# EAGLE design Jarduino (EAGLE 6.6.0)

## Sheet 1 of 2: Arduino | USB
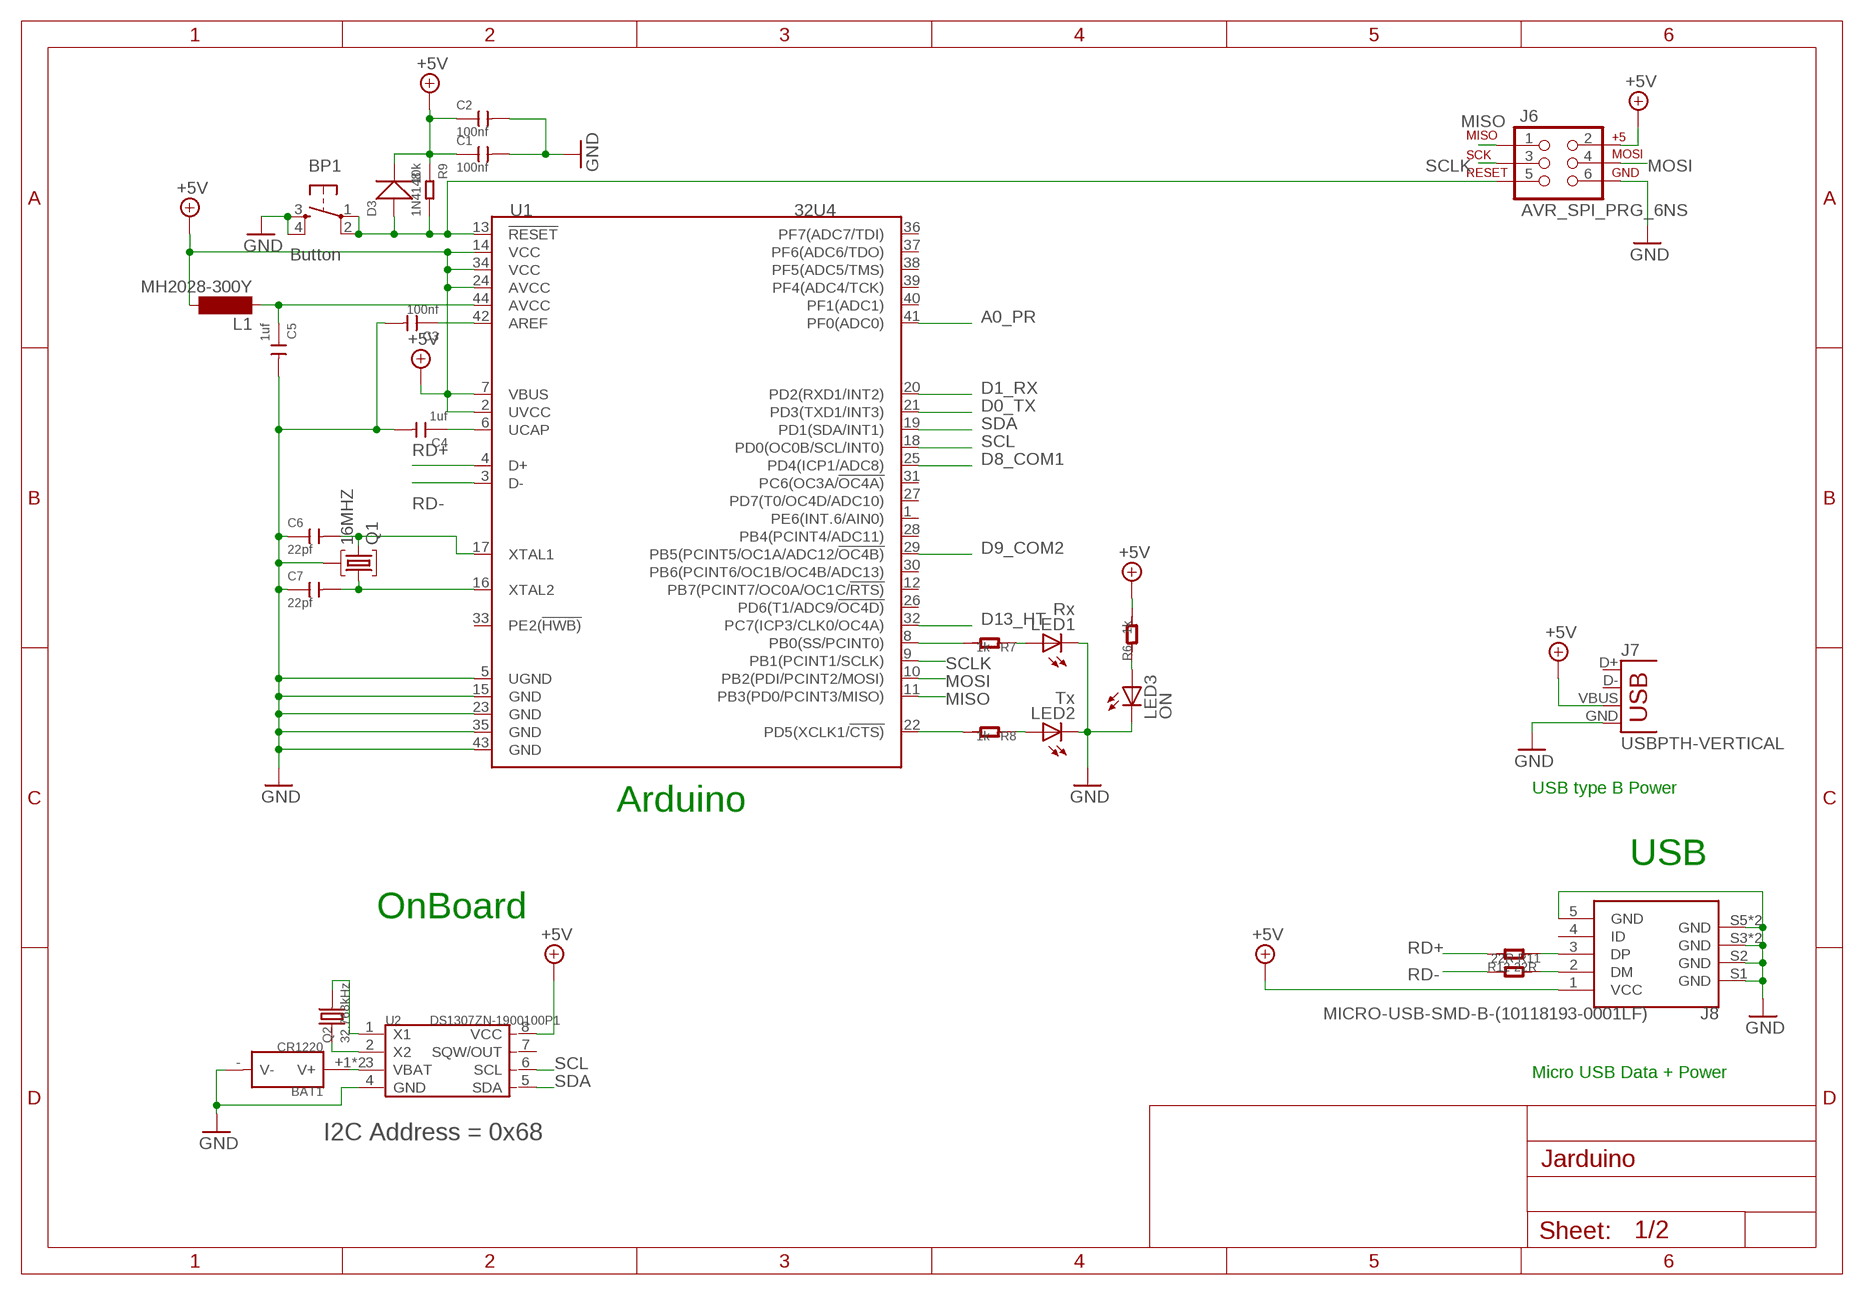
[diagram p0: schematic, sheet 1]

### Parts
BAT1  CR1220  BAT-HOLDER-1220  [METAL-CR1220-D13.5XH5.0MM]
BP1  Button  TAC_SWITCHPTH  [TACTILE-PTH]
C1  100nf  CERAMIC-100NF-50V-10%-X7R(0603)  [C0603]
C2  100nf  CERAMIC-100NF-50V-10%-X7R(0603)  [C0603]
C3  100nf  CERAMIC-100NF-50V-10%-X7R(0603)  [C0603]
C4  1uf  CERAMIC-100NF-50V-10%-X7R(0603)  [C0603]
C5  1uf  CERAMIC-100NF-50V-10%-X7R(0603)  [C0603]
C6  22pf  CERAMIC-100NF-50V-10%-X7R(0603)  [C0603]
C7  22pf  CERAMIC-100NF-50V-10%-X7R(0603)  [C0603]
D3  1N4148  DIODE'1N4148-SMD'  [LL-34]
J6  AVR_SPI_PRG_6NS  [2X3-NS]
J7  USBPTH-VERTICAL  [USB-B-PTH-VERTICAL]
J8  MICRO-USB-SMD-B-(10118193-0001LF)  [MICRO-USB5+6P-SMD-0.65-B]
L1  MH2028-300Y  SM-1206  [SM-1206]
LED1  Rx  LEDCHIP-LED0805  [CHIP-LED0805]
LED2  Tx  LEDCHIP-LED0805  [CHIP-LED0805]
LED3  ON  LEDCHIP-LED0805  [CHIP-LED0805]
Q1  16MHZ  8M10AHC49T  [HC49U]
Q2  32.768kHz  CRYSTAL-306010055  [2P-L3.2XW1.5MM]
R6  1k  R-0805  [R0805]
R7  1k  R-0805  [R0805]
R8  1k  R-0805  [R0805]
R9  10k  SMD-RES-1M-5%-1/8W(0805)  [R0805]
R11  22R  R-0805  [R0805]
R12  22R  R-0805  [R0805]
U1  32U4  MCU-ATMEGA32U4(TQFP44)-AU  [TQFP44-0.8-9.6X9.6MM]
U2  DS1307ZN-1900100P1  [SOIC8]

### Nets
+5V: C1.1 C2.1 D3.C(-) J6.2 J7.VBUS J8.1(VCC) L1.2 R6.2 R9.1 U1.2(UVCC) U1.7(VBUS) U1.14(VCC) U1.24(AVCC) U1.34(VCC) U2.8(VCC) ; also sheet 2
A0_PR: U1.41(PF0(ADC0)) ; also sheet 2
D0_TX: U1.21(PD3(TXD1/INT3)) ; also sheet 2
D1_RX: U1.20(PD2(RXD1/INT2)) ; also sheet 2
D8_COM1: U1.25(PD4(ICP1/ADC8)) ; also sheet 2
D9_COM2: U1.29(PB5(PCINT5/OC1A/ADC12/!OC4B)) ; also sheet 2
D13_HT: U1.32(PC7(ICP3/CLK0/OC4A)) ; also sheet 2
GND: BAT1.-(V-) BP1.3 BP1.4 C1.2 C2.2 C3.2 C4.2 C5.2 C6.1 C7.1 J6.6 J7.GND J8.5(GND) J8.S1(GND) J8.S2(GND) J8.S3(GND) J8.S4(GND) J8.S5(GND) J8.S6(GND) LED1.C LED2.C LED3.C Q1.2 U1.5(UGND) U1.15(GND) U1.23(GND) U1.35(GND) U1.43(GND) U2.4(GND) ; also sheet 2
MISO: J6.1 U1.11(PB3(PD0/PCINT3/MISO))
MOSI: J6.4 U1.10(PB2(PDI/PCINT2/MOSI))
N$2: LED3.A R6.1
N$3: R7.2 U1.8(PB0(SS/PCINT0))
N$4: J8.2(DM) R12.2
N$5: R8.2 U1.22(PD5(XCLK1/!CTS))
N$7: LED1.A R7.1
N$8: LED2.A R8.1
N$10: C6.2 Q1.3 U1.17(XTAL1)
N$12: C4.1 U1.6(UCAP)
N$13: C5.1 L1.1 U1.44(AVCC)
N$14: C3.1 U1.42(AREF)
N$15: C7.2 Q1.1 U1.16(XTAL2)
N$16: J8.3(DP) R11.1
N$38: Q2.2 U2.1(X1)
N$39: Q2.1 U2.2(X2)
N$40: BAT1.+1(V+) BAT1.+2(V+) U2.3(VBAT)
RD+: R11.2 U1.4(D+)
RD-: R12.1 U1.3(D-)
RESET: BP1.1 BP1.2 D3.A(+) J6.5 R9.2 U1.13(!RESET)
SCL: U1.18(PD0(OC0B/SCL/INT0)) U2.6(SCL) ; also sheet 2
SCLK: J6.3 U1.9(PB1(PCINT1/SCLK))
SDA: U1.19(PD1(SDA/INT1)) U2.5(SDA) ; also sheet 2
Unconnected: J7.D+ J7.D- J8.4(ID) U1.1(PE6(INT.6/AIN0)) U1.12(PB7(PCINT7/OC0A/OC1C/!RTS)) U1.26(PD6(T1/ADC9/!OC4D)) U1.27(PD7(T0/OC4D/ADC10)) U1.28(PB4(PCINT4/ADC11)) U1.30(PB6(PCINT6/OC1B/OC4B/ADC13)) U1.31(PC6(OC3A/!OC4A)) U1.33(PE2(!HWB)) U1.36(PF7(ADC7/TDI)) U1.37(PF6(ADC6/TDO)) U1.38(PF5(ADC5/TMS)) U1.39(PF4(ADC4/TCK)) U1.40(PF1(ADC1)) U2.7(SQW/OUT)

### Notes on the sheet
- USB type B Power
- Arduino
- USB
- OnBoard
- Micro USB Data + Power
- I2C Address = 0x68

## Sheet 2 of 2: Relay
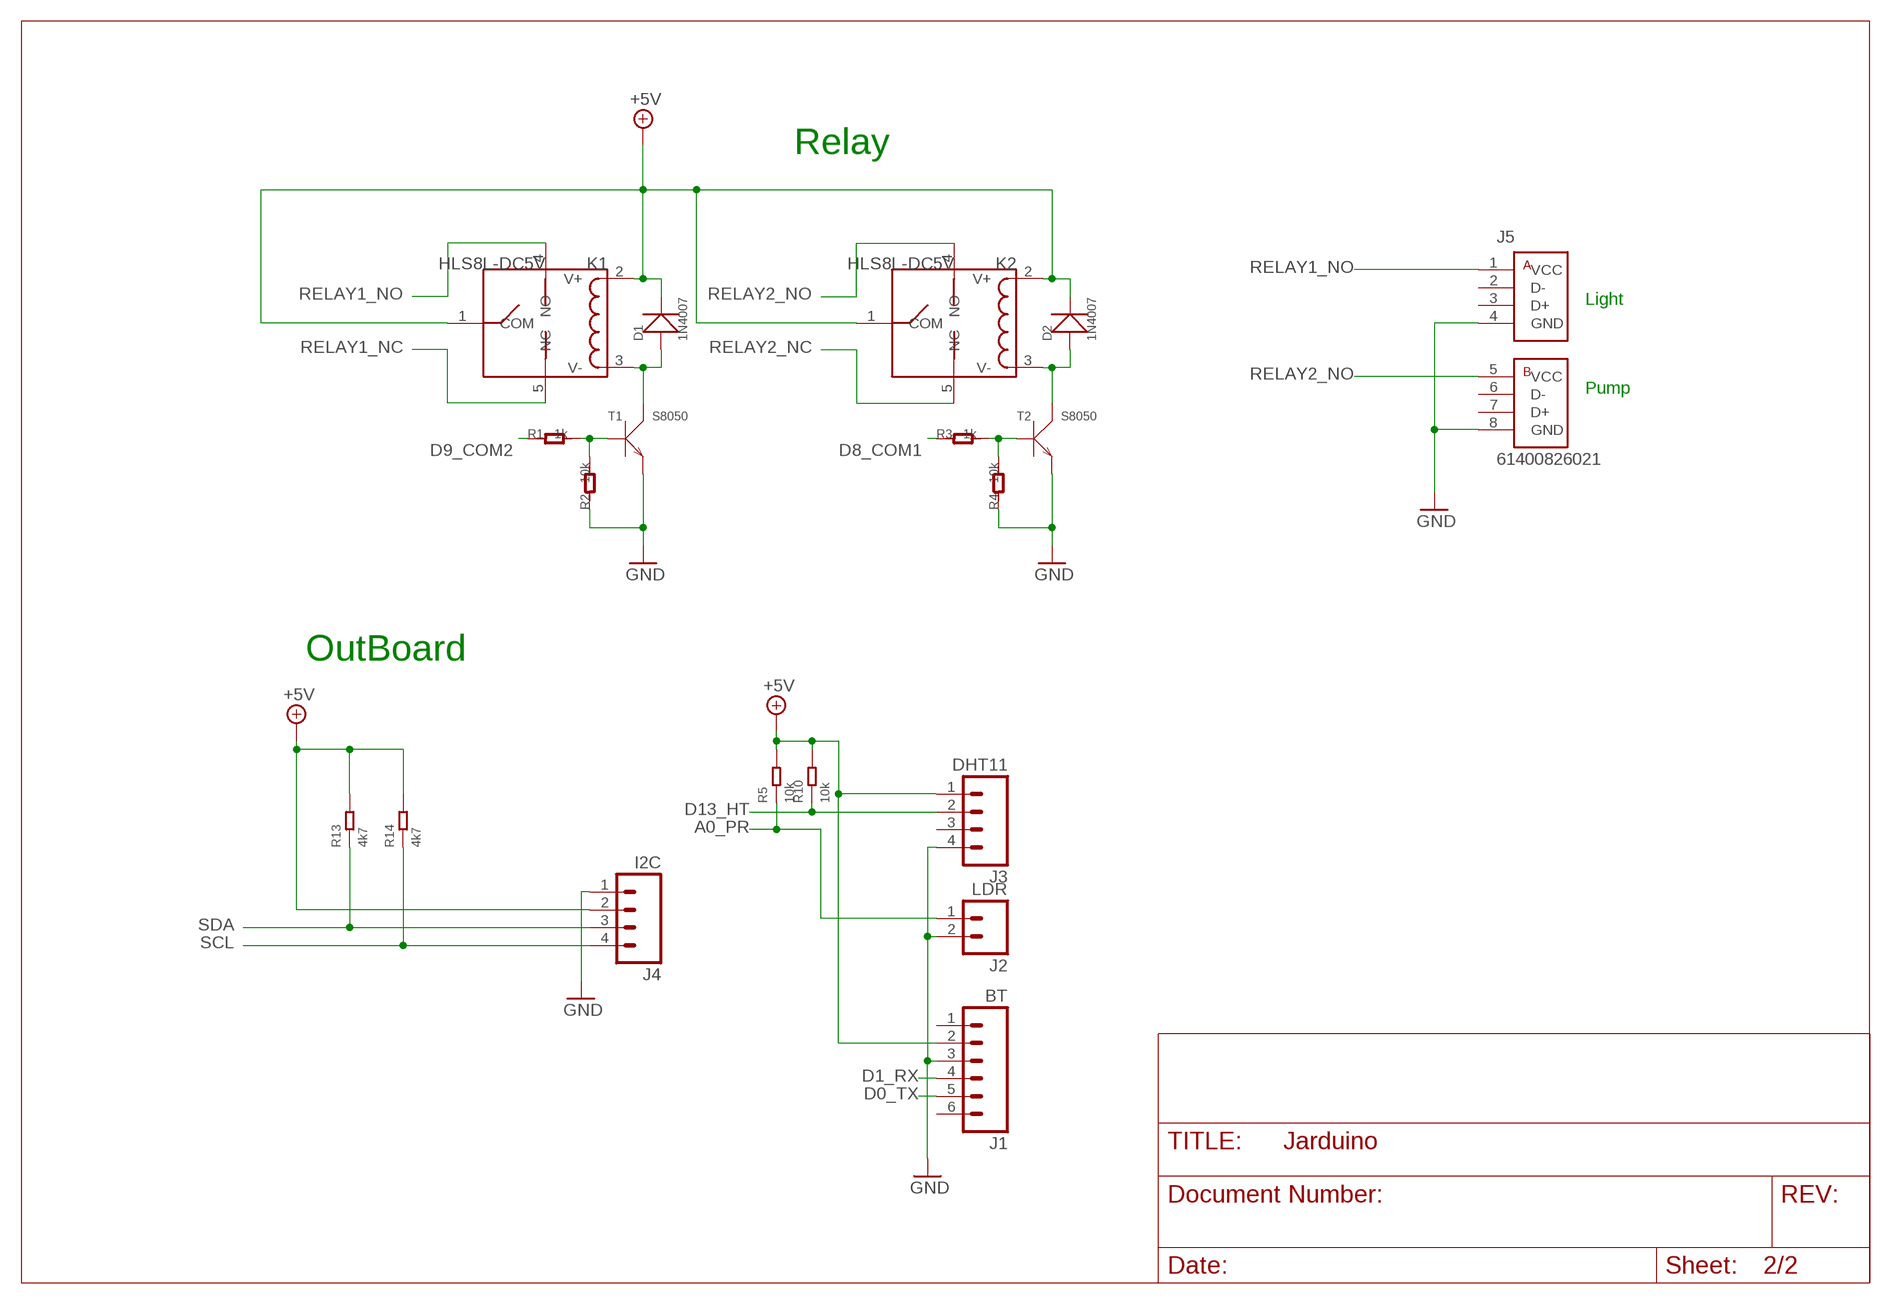
[diagram p1: schematic, sheet 2]

### Parts
D1  1N4007  DIODE-SMA  [DO-214AC]
D2  1N4007  DIODE-SMA  [DO-214AC]
J1  BT  M06POLAR  [MOLEX-1X6]
J2  LDR  M02POLAR  [MOLEX-1X2]
J3  DHT11  M04POLAR  [MOLEX-1X4]
J4  I2C  M04POLAR  [MOLEX-1X4]
J5  61400826021  [61400826021]
K1  HLS8L-DC5V  RELAY-HLS8L-DC5V-S-C-315030000  [5P-L19.0XW15.0XH15.0MM]
K2  HLS8L-DC5V  RELAY-HLS8L-DC5V-S-C-315030000  [5P-L19.0XW15.0XH15.0MM]
R1  1k  R-0805  [R0805]
R2  10k  R-0805  [R0805]
R3  1k  R-0805  [R0805]
R4  10k  R-0805  [R0805]
R5  10k  RES-0805  [R0805]
R10  10k  RES-0805  [R0805]
R13  4k7  RES-0805  [R0805]
R14  4k7  RES-0805  [R0805]
T1  S8050  TRANSISTOR-NPN-''  [SOT23]
T2  S8050  TRANSISTOR-NPN-''  [SOT23]

### Nets
+5V: D1.2(-) D2.2(-) J1.2 J3.1 J4.2 K1.1(COM) K1.2(V+) K2.1(COM) K2.2(V+) R5.2 R10.2 R13.2 R14.2 ; also sheet 1
A0_PR: J2.1 R5.1 ; also sheet 1
D0_TX: J1.5 ; also sheet 1
D1_RX: J1.4 ; also sheet 1
D8_COM1: R3.1 ; also sheet 1
D9_COM2: R1.1 ; also sheet 1
D13_HT: J3.2 R10.1 ; also sheet 1
GND: J1.3 J2.2 J3.4 J4.1 J5.4(GND) J5.8(GND) R2.1 R4.1 T1.2(E) T2.2(E) ; also sheet 1
N$25: R3.2 R4.2 T2.1(B)
N$28: D2.1(+) K2.3(V-) T2.3(C)
N$29: R1.2 R2.2 T1.1(B)
N$30: D1.1(+) K1.3(V-) T1.3(C)
RELAY1_NC: K1.5(NC)
RELAY1_NO: J5.1(VCC) K1.4(NO)
RELAY2_NC: K2.5(NC)
RELAY2_NO: J5.5(VCC) K2.4(NO)
SCL: J4.4 R14.1 ; also sheet 1
SDA: J4.3 R13.1 ; also sheet 1
Unconnected: J1.1 J1.6 J3.3 J5.2(D-) J5.3(D+) J5.6(D-) J5.7(D+)

### Notes on the sheet
- Relay
- Light
- Pump
- OutBoard

## Library data of the parts
BAT1 = Connector:BAT-HOLDER: METAL-CR1220-D13.5*H5.0MM:320170002;METAL-CR1632-SMD:320170007;METAL-CR2032-D20.0*H6.3MM:320170003;METAL-CR2032-SMD:320170006;PLASTIC-CR1220-L15.06*W13.0*H4.1MM:320170000;PLASTIC-CR2032-L25.2*W15.6*H5.2MM:320170005
BP1 = SparkFun-Retired:TAC_SWITCH: Momentary Switch Button commonly used for reset or general input. Spark Fun Electronics SKU : COM-00097 SMT- SWCH-08247
C1-C3 = Seeed-OPL-Capacitor:CERAMIC-100NF-50V-10%-X7R(0603): 302010138; MPN: CC0603KRX7R9BB104
C4-C7 = Seeed-OPL-Capacitor:CERAMIC-100NF-50V-10%-X7R(0603): 302010138; MPN: CC0603KRX7R9BB104; VALUE: 100nf
D1 D2 = Seeedstudio_Discrete:DIODE*
D3 = Seeed-OPL-Diode:DIODE*
J1 = SparkFun-Connectors:M06: Header 6 Standard 6-pin 0.1" header. Use with straight break away headers (SKU : PRT-00116), right angle break away headers (PRT-00553), swiss pins (PRT-00743), machine pins (PRT-00117), and female headers (PRT-00115). Molex polarized connector foot print use with SKU : PRT-08094 with associated crimp pins and housings. NOTES ON THE VARIANTS LOCK and LOCK_LONGPADS... This footprint was designed to help hold the alignment of a through-hole component (i.e. 6-pin header) while soldering it into place. You may notice that each hole has been shifted either up or down by 0.005 of an inch from it's more standard position (which is a perfectly straight line). This slight alteration caused the pins (the squares in the middle) to touch the edges of the holes. Because they are alternating, it causes a "brace" to hold the component in place. 0.005 has proven to be the perfect amount of "off-center" position when using our standard breakaway headers. Although looks a little odd when you look at the bare footprint, once you have a header in there, the alteration is very hard to notice. Also,if you push a header all the way into place, it is covered up entirely on the bottom side. This idea of altering the position of holes to aid alignment will be further integrated into the Sparkfun Library for other footprints. It can help hold any component with 3 or more connection pins.
J2 = SparkFun-Connectors:M02: Standard 2-pin 0.1" header. Use with - straight break away headers ( PRT-00116) - right angle break away headers (PRT-00553) - swiss pins (PRT-00743) - machine pins (PRT-00117) - female headers (PRT-00115) Molex polarized connector foot print use with: PRT-08233 with associated crimp pins and housings. 2.54_SCREWTERM for use with PRT-10571. 3.5mm Screw Terminal footprints for PRT-08084 5mm Screw Terminal footprints for use with PRT-08432
J3 J4 = SparkFun-Connectors:M04: Header 4 Standard 4-pin 0.1" header. Use with straight break away headers (SKU : PRT-00116), right angle break away headers (PRT-00553), swiss pins (PRT-00743), machine pins (PRT-00117), and female headers (PRT-00115). Molex polarized connector foot print use with SKU : PRT-08231 with associated crimp pins and housings. 1MM SMD Version SKU: PRT-10208
J5 = Eagle_INPUT_OUTPUT_CONNECTORS_rev15d:61400826021: WR-COM Horizontal Dual Stacked USB Type A=>Code : Con_I-O_COM_USB-2.0_A_61400826021 <http://katalog.we-online.de/media/images/eican/Con_I-O_COM_USB-2.0_A_61400826021_pf2.jpg> Details see: http://katalog.we-online.de/en/em/614_008_260_21 Created 2014-07-09, Karrer Zheng 2014 (C) Würth Elektronik
J6 = SparkFun-Connectors:AVR_SPI_PRG_6: AVR ISP 6 Pin This is the reduced ISP connector for AVR programming. Common on Arduino. This footprint will take up less PCB space and can be used with a 10-pin to 6-pin adapter such as SKU: BOB-08508 **Special note about "TEST_POINT" package. The stop mask is on the top side, so if you want your programming test points to be on the bottom of your board, make sure to place this package on the bottom side of the board. This also ensure that the orientation to program from the bottom side will be correct.
J7 = SparkFun-Connectors:USB: USB Connectors USB-B-PTH is fully proven SKU : PRT-00139/CONN-08278 USB-miniB is fully proven SKU : PRT-00587 USB-A-PCB is untested. USB-A-H is throughly reviewed, but untested. Spark Fun Electronics SKU : PRT-00437 USB-B-SMT is throughly reviewed, but untested. Needs silkscreen touching up. USB-A-S has not been used/tested USB-MB-H has not been used/tested USB-MICROB has been used. CONN-09505
J8 = Seeed-OPL-Connector:MICRO-USB-SMD-B-(10118193-0001LF): 320010003; MPN: 10118193-0001LF
K1 K2 = Seeedstudio_Connector:RELAY-HLS8L-DC5V-S-C
L1 = inductor-neosid:SM-1206: INDUCTOR SMD chip inductor; OC_FARNELL: unknown; OC_NEWARK: unknown
LED1-LED3 = led:LED: LED OSRAM: - CHIPLED LG R971, LG N971, LY N971, LG Q971, LY Q971, LO R971, LY R971 LH N974, LH R974 LS Q976, LO Q976, LY Q976 LO Q996 - Hyper CHIPLED LW Q18S LB Q993, LB Q99A, LB R99A - SideLED LS A670, LO A670, LY A670, LG A670, LP A670 LB A673, LV A673, LT A673, LW A673 LH A674 LY A675 LS A676, LA A676, LO A676, LY A676, LW A676 LS A679, LY A679, LG A679 - Hyper Micro SIDELED® LS Y876, LA Y876, LO Y876, LY Y876 LT Y87S - SmartLED LW L88C, LW L88S LB L89C, LB L89S, LG L890 LS L89K, LO L89K, LY L89K LS L896, LA L896, LO L896, LY L896 - TOPLED LS T670, LO T670, LY T670, LG T670, LP T670 LSG T670, LSP T670, LSY T670, LOP T670, LYG T670 LG T671, LOG T671, LSG T671 LB T673, LV T673, LT T673, LW T673 LH T674 LS T676, LA T676, LO T676, LY T676, LB T676, LH T676, LSB T676, LW T676 LB T67C, LV T67C, LT T67C, LS T67K, LO T67K, LY T67K, LW E67C LS E67B, LA E67B, LO E67B, LY E67B, LB E67C, LV E67C, LT E67C LW T67C LS T679, LY T679, LG T679 LS T770, LO T770, LY T770, LG T770, LP T770 LB T773, LV T773, LT T773, LW T773 LH T774 LS E675, LA E675, LY E675, LS T675 LS T776, LA T776, LO T776, LY T776, LB T776 LHGB T686 LT T68C, LB T68C - Hyper Mini TOPLED® LB M676 - Mini TOPLED Santana® LG M470 LS M47K, LO M47K, LY M47K Source: http://www.osram.convergy.de LUXEON: - LUMILED® LXK2-PW12-R00, LXK2-PW12-S00, LXK2-PW14-U00, LXK2-PW14-V00 LXK2-PM12-R00, LXK2-PM12-S00, LXK2-PM14-U00 LXK2-PE12-Q00, LXK2-PE12-R00, LXK2-PE12-S00, LXK2-PE14-T00, LXK2-PE14-U00 LXK2-PB12-K00, LXK2-PB12-L00, LXK2-PB12-M00, LXK2-PB14-N00, LXK2-PB14-P00, LXK2-PB14-Q00 LXK2-PR12-L00, LXK2-PR12-M00, LXK2-PR14-Q00, LXK2-PR14-R00 LXK2-PD12-Q00, LXK2-PD12-R00, LXK2-PD12-S00 LXK2-PH12-R00, LXK2-PH12-S00 LXK2-PL12-P00, LXK2-PL12-Q00, LXK2-PL12-R00 Source: www.luxeon.com KINGBRIGHT: KA-3528ASYC Source: www.kingbright.com
Q1 = crystal:8M10AHC49T: Monolithic Crystal Filters Source: www.vanlong.com; OC_FARNELL: unknown; OC_NEWARK: unknown
Q2 = Discrete2:CRYSTAL*
R1-R4 R6-R8 R11 R12 = Seeedstudio_Discrete:R*
R5 R10 R13 R14 = Discrete2:RES
R9 = Seeed-OPL-Resistor:SMD-RES-1M-5%-1/8W(0805): 301010321; MPN: RC0805JR-071ML; VALUE: 1M
T1 T2 = Seeedstudio_Discrete:TRANSISTOR-NPN*: NPN Transistor
U1 = Seeed-OPL-ic:MCU-ATMEGA32U4(TQFP44): 310010010; MPN: ATMEGA32U4
U2 = IC:DS1307ZN: 34X8 serial Real-Time Clock

## Board
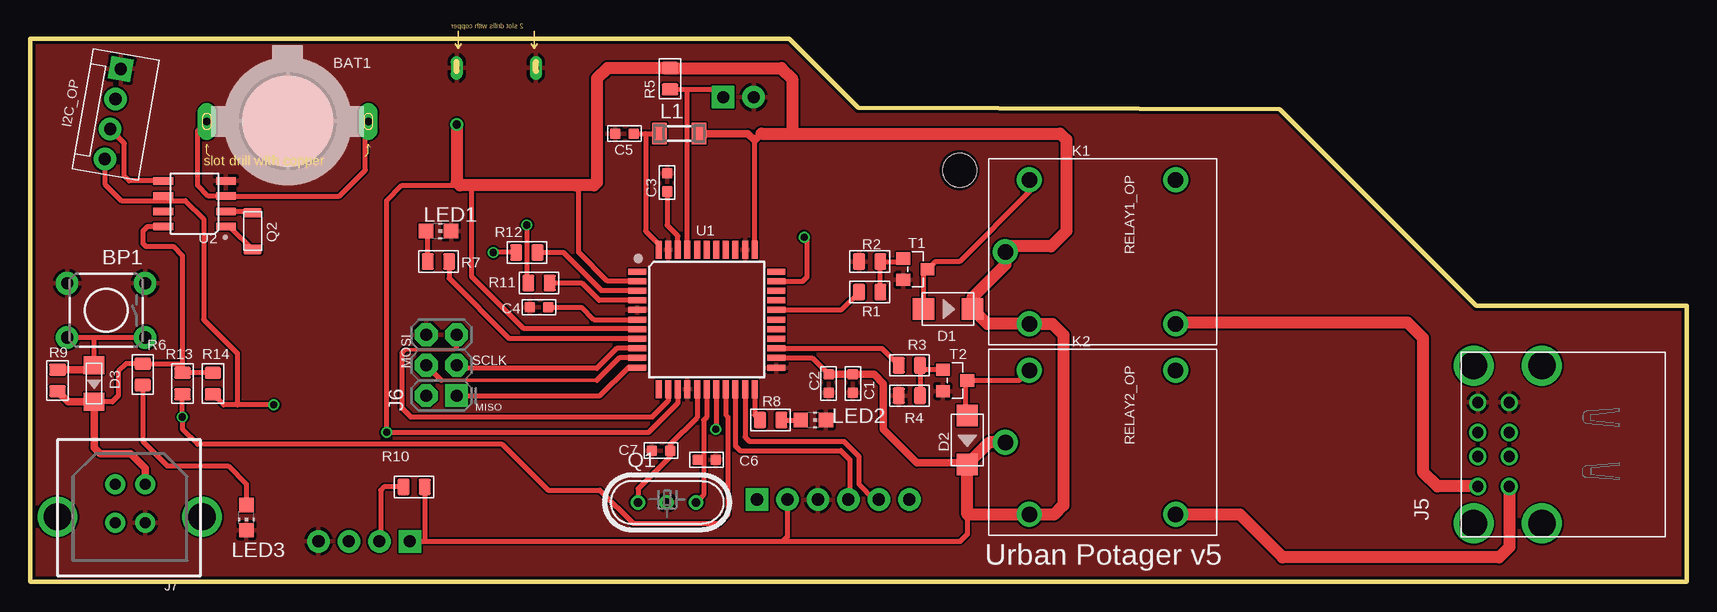
[diagram p2: board, top side]
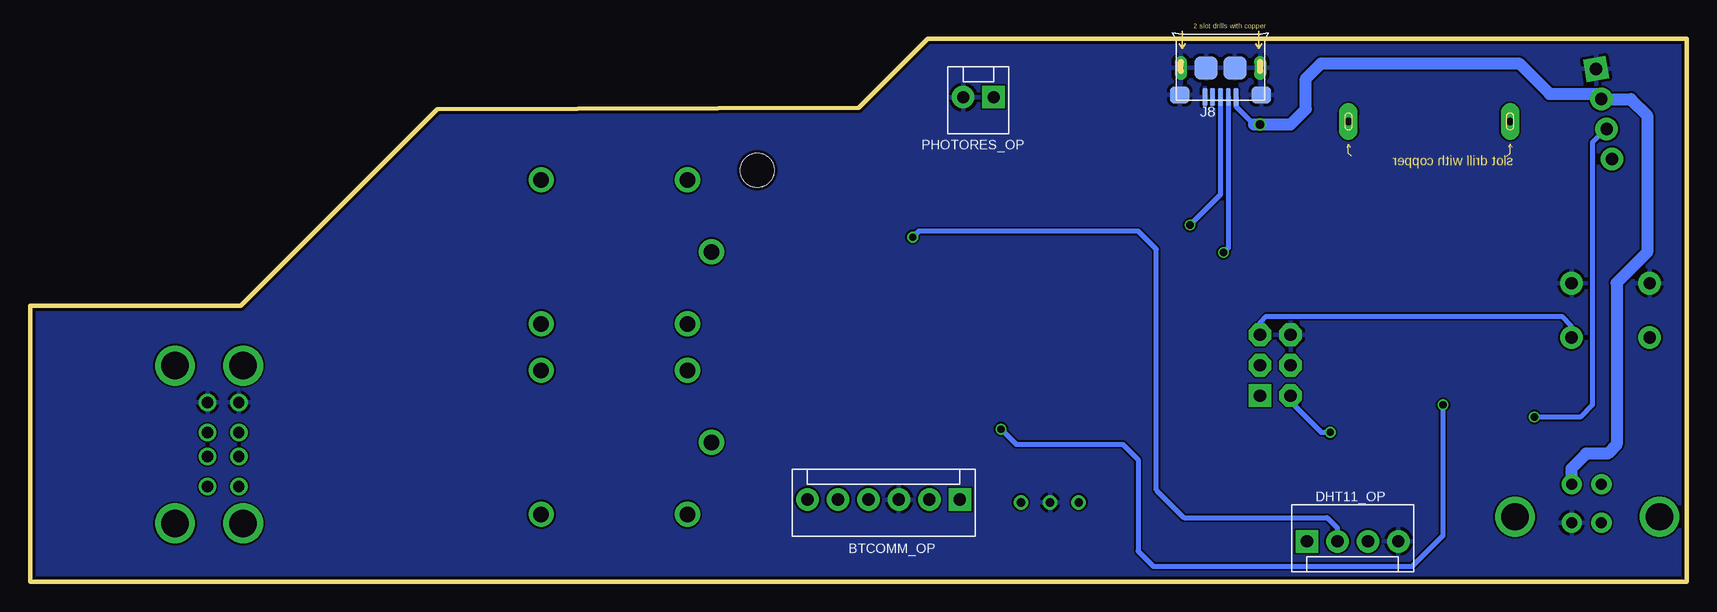
[diagram p3: board, bottom side, seen from below]

Size 138.07 x 45.23 mm. Coordinates in mm from the lower left corner, seen from the top.
Outline: 0,45.23 0,0 138.07,0 138.07,22.99 120.52,22.99 104.14,39.37 69,39.5 63.27,45.23 0,45.23
Copper layers (1*16): Top 0.035mm / dielectric 1.5mm / Bottom 0.035mm
Design rules "SeeedStudio_2layer_DRU_no_angle_20140221 *": minimum track width 6mil, minimum drill 12mil, track to track 6mil, track to pad 6mil, pad to pad 6mil, via to via 6mil, smd to smd 0mil, copper to edge 10mil, drill to drill 10mil, minimum pad ring 10mil, minimum via ring 6mil, stop-mask expansion 2mil, vias tented up to drill 100mil, thermal gap 10mil
Holes 2.8 mm at 77.47,34.29

### Footprints (pad centres in the part's own frame; a part is rotated, then mirrored left to right if it is on the bottom)
METAL-CR1220-D13.5XH5.0MM = drill 0.635 pad 1.524 long: +1 6.731,0; +2 -6.731,0 | smd 7.62 x 7.62: - 0,0
TACTILE-PTH = drill 1.016 pad 1.88: 1 -3.251,2.261; 2 3.251,2.261; 3 -3.251,-2.261; 4 3.251,-2.261
C0603 = smd 0.889 x 0.889: 1 0,0.762; 2 0,-0.762
DO-214AC = smd 1.8 x 1.77: 1 -2.042,0; 2 2.042,0
LL-34 = smd 1.524 x 1.676: A -1.524,0; C 1.524,0
MOLEX-1X6 = drill 1.016 pad 1.88 square: 1 0,0 | drill 1.016 pad 1.88: 2 2.54,0; 3 5.08,0; 4 7.62,0; 5 10.16,0; 6 12.7,0
MOLEX-1X2 = drill 1.016 pad 1.88 square: 1 0,0 | drill 1.016 pad 1.88: 2 2.54,0
MOLEX-1X4 = drill 1.016 pad 1.88 square: 1 0,0 | drill 1.016 pad 1.88: 2 2.54,0; 3 5.08,0; 4 7.62,0
61400826021 = drill 0.92: 1 -3.5,5.33; 2 -1,5.33; 3 1,5.33; 4 3.5,5.33; 5 -3.5,2.71; 6 -1,2.71; 7 1,2.71; 8 3.5,2.71 | drill 2.3: 9 -6.57,5.68; 10 6.57,5.68; 11 6.57,0; 12 -6.57,0
2X3-NS = drill 1.016 pad 1.88 square: 1 -2.54,-1.27 | drill 1.016 pad 1.88 octagon: 2 -2.54,1.27; 3 0,-1.27; 4 0,1.27; 5 2.54,-1.27; 6 2.54,1.27
USB-B-PTH-VERTICAL = drill 0.914 pad 1.676: D+ 4.826,4.394; D- 4.826,7.595; GND 7.315,4.394; VBUS 7.315,7.595 | drill 2.286: P$1 0,4.902; P$2 12.04,4.902
MICRO-USB5+6P-SMD-0.65-B = smd 0.4 x 1.5: 1 -1.3,-0.25; 2 -0.65,-0.25; 3 0,-0.25; 4 0.65,-0.25; 5 1.3,-0.25 | smd 1.6 x 1.4: S1 -3.4,-0.427; S6 3.4,-0.427 | drill 0.508 pad 1.016 long: S2 -3.3,-2.675; S5 3.3,-2.675 | smd 1.9 x 1.9: S3 -1.2,-2.675; S4 1.2,-2.675
5P-L19.0XW15.0XH15.0MM = drill 1.3 pad 2.1: 1 -8.1,0; 2 -6.1,-6; 3 -6.1,6; 4 6.1,-6; 5 6.1,6
SM-1206 = smd 1.2 x 1.8: 1 -1.65,0; 2 1.65,0
CHIP-LED0805 = smd 1.2 x 1.2: A 0,-1.05; C 0,1.05
HC49U = drill 0.7 pad 1.2: 1 -2.413,0; 2 -0.027,0; 3 2.413,0
2P-L3.2XW1.5MM = smd 0.762 x 1.524: 1 -1.524,0; 2 1.524,0
R0805 = smd 1.016 x 1.397: 1 -0.889,0; 2 0.889,0
R0805' = smd 1.397 x 1.016: 1 0,0.889; 2 0,-0.889
SOT23 = smd 1.016 x 1.143: 1 -0.889,-1.016; 2 0.889,-1.016; 3 0,1.016
TQFP44-0.8-9.6X9.6MM = smd 1.5 x 0.5: 1 -5.8,4; 2 -5.8,3.2; 3 -5.8,2.4; 4 -5.8,1.6; 5 -5.8,0.8; 6 -5.8,0; 7 -5.8,-0.8; 8 -5.8,-1.6; 9 -5.8,-2.4; 10 -5.8,-3.2; 11 -5.8,-4; 23 5.8,-4; 24 5.8,-3.2; 25 5.8,-2.4; 26 5.8,-1.6; 27 5.8,-0.8; 28 5.8,0; 29 5.8,0.8; 30 5.8,1.6; 31 5.8,2.4; 32 5.8,3.2; 33 5.8,4 | smd 0.5 x 1.5: 12 -4,-5.8; 13 -3.2,-5.8; 14 -2.4,-5.8; 15 -1.6,-5.8; 16 -0.8,-5.8; 17 0,-5.8; 18 0.8,-5.8; 19 1.6,-5.8; 20 2.4,-5.8; 21 3.2,-5.8; 22 4,-5.8; 34 4,5.8; 35 3.2,5.8; 36 2.4,5.8; 37 1.6,5.8; 38 0.8,5.8; 39 0,5.8; 40 -0.8,5.8; 41 -1.6,5.8; 42 -2.4,5.8; 43 -3.2,5.8; 44 -4,5.8
SOIC8 = smd 1.651 x 0.635: 1 -2.616,1.905; 2 -2.616,0.635; 3 -2.616,-0.635; 4 -2.616,-1.905; 5 2.616,-1.905; 6 2.616,-0.635; 7 2.616,0.635; 8 2.616,1.905

### Placement (x,y rotation side)
BAT1  21.46,38.35 0 top
BP1  6.35,22.61 180 top
C1  68.58,16.51 0 top
C2  66.55,16.51 0 top
C3  53.09,33.27 180 top
C4  42.42,22.86 270 top
C5  49.53,37.34 270 top
C6  56.39,10.16 270 top
C7  52.58,10.92 90 top
D1  76.5,22.72 0 top
D2  78.11,11.81 270 top
D3  5.33,16.51 270 top
J1  60.58,6.84 180 bottom
J2  57.76,40.37 180 bottom
J3  31.66,3.36 0 bottom
J4  7.56,42.72 260 top
J5  125.98,11.43 90 top
J6  34.29,18.03 90 top
J7  2.29,0.51 0 top
J8  38.86,40.13 180 bottom
K1  89.38,27.48 0 top
K2  89.38,11.61 0 top
L1  54.1,37.34 0 top
LED1  34.04,29.21 270 top
LED2  65.28,13.46 270 top
LED3  18.03,5.33 180 top
Q1  53.09,6.6 0 top
Q2  18.54,29.21 270 top
R1  69.98,24.13 0 top
R2  69.98,26.67 0 top
R3  73.28,18.03 0 top
R4  73.28,15.49 0 top
R5  10k  [R0805']  53.34,41.91 180 top
R6  9.4,17.27 90 top
R7  34.04,26.67 0 top
R8  61.72,13.46 180 top
R9  10k  [R0805']  2.29,16.76 180 top
R10  10k  [R0805']  32.01,7.9 90 top
R11  42.42,24.89 0 top
R12  41.4,27.43 180 top
R13  4k7  [R0805']  12.7,16.51 180 top
R14  4k7  [R0805']  15.24,16.51 180 top
T1  73.79,26.04 270 top
T2  77.09,16.76 270 top
U1  56.39,21.84 0 top
U2  13.72,31.5 180 top

### Tracks (layer width: path | path; a pad name or v marks a point on that pad's centre or on a via)
+5V  (via drill 0.6, 0.7)
  Top 0.406: C2.1 65.18,18.64 U1.24 | 36.83,33.02 36.83,25.4 41.15,21.08 50.55,21.08 U1.7 | 45.72,32.77 45.72,27.43 48.11,25.04 U1.2 | 83.26,5.59 K2.2 | 77.97,9.91 D2.2 78.11,3.94 77.53,3.36 62.74,3.36 | U1.34 60.39,36.77 | U2.8 9.78,29.59 9.4,29.21 9.4,28.19 9.65,27.94 11.94,27.94 12.7,27.18 12.7,18.03 | 12.7,18.03 R13.2 R14.2 | 12.7,18.03 12.57,18.16 R6.2 8,18.16 7.37,17.53 7.37,15.49 6.86,14.99 D3.C | U1.14 53.99,14.87 51.56,12.45 v29.72,12.45 29.72,31.75 30.99,33.02 35.81,33.02 | J3.1 33.02,3.36 | 33.02,3.36 62.74,3.36 | J1.2 63.12,3.74 62.74,3.36 | R10.2 32.9,3.48 33.02,3.36
  Top 0.61: C2.1 C1.1 70.36,17.27 71.12,16.51 71.12,12.7 73.91,9.91 77.97,9.91 | 45.72,32.77 45.47,33.02 | 60.96,37.34 60.39,36.77 59.82,37.34 L1.2 | R9.1 3.17,14.99 D3.C 5.33,11.18 5.84,10.67 8.38,10.67 9.6,9.45 J7.VBUS
  Top 1.016: K2.2 85.34,5.61 85.34,5.59 86.11,6.35 86.11,20.57 85.2,21.48 K1.2 79.78,21.48 D1.2 78.54,23.68 81.28,26.41 K1.1 81.73,27.94 85.09,27.94 86.36,29.21 86.36,36.83 85.85,37.34 63.5,37.34 | K2.1 79.94,11.61 D2.2 78.11,5.59 83.26,5.59 | 60.96,37.34 63.5,37.34 | 63.5,37.34 63.5,41.91 62.61,42.8 R5.2 48.13,42.8 47.24,41.91 47.24,33.27 46.99,33.02 45.47,33.02 36.83,33.02 35.81,33.02 35.56,33.27 v35.56,38.1
  Bottom 0.406: J8.1 37.56,39.59 36.07,38.1 | J6.2 33.02,14.99 30.48,12.45 v29.72,12.45
  Bottom 1.016: J7.VBUS 9.6,9.45 8.38,10.67 6.6,10.67 5.84,11.43 5.84,24.89 3.3,27.43 3.3,38.86 4.66,40.22 J4.2 7.54,40.64 11.43,40.64 13.97,43.18 30.48,43.18 31.75,41.91 31.75,39.37 33.02,38.1 v35.56,38.1 36.07,38.1
A0_PR
  Top 0.406: U1.41 54.79,40.95 54.86,41.02 | R5.1 54.86,41.02 | 54.86,41.02 57.11,41.02 J2.1
D0_TX
  Top 0.406: U1.21 59.59,12.04 59.94,11.68 67.82,11.68 69.09,10.41 69.09,8.13 70.37,6.84 J1.5
D1_RX
  Top 0.406: U1.20 58.79,11.32 59.18,10.92 67.56,10.92 68.33,10.16 68.33,6.97 J1.4
D8_COM1
  Top 0.406: U1.25 70.98,19.44 R3.1
D9_COM2
  Top 0.406: U1.29 67.6,22.64 R1.1
D13_HT  (via drill 0.6)
  Top 0.406: U1.32 64.41,25.04 64.77,25.4 64.77,28.45 v64.52,28.7 | R10.1 29.49,7.9 29.21,7.62 29.21,3.46 J3.2
  Bottom 0.406: J3.2 29.11,4.48 29.97,5.33 41.91,5.33 44.2,7.62 44.2,27.69 45.72,29.21 64.01,29.21 v64.52,28.7
GND
  pour Bottom: 0,45.23 0,0 138.07,0 138.07,22.96 120.55,22.96 104.14,39.37 69,39.5 63.27,45.23
  pour Top (rank 6): 0,45.23 0,0 138.07,0 138.07,22.96 120.55,22.96 104.14,39.37 69,39.48 63.27,45.23
MISO
  Top 0.406: J6.1 47.5,15.49 49.85,17.84 U1.11
MOSI
  Top 0.305: 47.24,16.76 34.29,16.76
  Top 0.406: U1.10 49.12,18.64 47.24,16.76 | 34.29,16.76 J6.4
N$2
  Top 0.406: R6.1 9.4,11.68 11.43,9.65 16.51,9.65 18.03,8.13 LED3.A
N$3
  Top 0.406: U1.8 39.95,20.24 34.92,25.27 R7.2
N$4  (via drill 0.6)
  Top 0.406: R12.2 v38.61,27.43
  Bottom 0.406: J8.2 38.21,27.83 v38.61,27.43
N$5
  Top 0.406: U1.22 60.39,13.91 R8.2
N$7
  Top 0.406: R7.1 33.15,29.05 LED1.A
N$8
  Top 0.406: 63.97,13.21 LED2.A R8.1
N$10
  Top 0.406: U1.17 56.39,13.72 56.13,13.46 56.13,10.16 | 56.13,10.16 56.13,7.24 Q1.3 | C6.2 56.13,10.16
N$12
  Top 0.406: C4.1 45.97,22.86 46.99,21.84 U1.6
N$13
  Top 0.406: C5.1 51.31,37.34 | 51.31,37.34 L1.1 | U1.44 52.39,28.13 51.44,29.08 51.31,29.21 51.31,37.34
N$14
  Top 0.406: C3.1 53.09,29.72 53.99,28.82 U1.42
N$15
  Top 0.406: Q1.1 50.67,7.75 53.34,10.41 C7.2 53.34,11.43 55.59,13.68 U1.16
N$16  (via drill 0.6)
  Top 0.406: v41.4,29.72 41.4,25.02 R11.1
  Bottom 0.406: J8.3 38.86,32.26 v41.4,29.72
N$25
  Top 0.406: T2.1 74.55,17.65 R3.2 R4.2
N$28
  Top 0.406: D2.1 77.99,13.97 77.99,16.65 T2.3 82.43,16.76 K2.3
N$29
  Top 0.406: R1.2 R2.2 72.52,26.67 T1.1
N$30
  Top 0.406: D1.1 74.46,25.69 T1.3 75.44,26.67 77.47,26.67 83.28,32.48 K1.3
N$38
  Top 0.406: U2.1 16.64,29.59 Q2.2
N$39
  Top 0.406: U2.2 18.41,30.86 Q2.1
N$40
  Top 0.406: BAT1.+1 27.94,38.1 27.94,34.29 25.78,32.13 U2.3 14.86,32.13 13.97,33.02 13.97,37.59 BAT1.+2
RD+
  Top 0.406: U1.4 47.42,23.44 45.97,24.89 R11.2
RD-
  Top 0.406: U1.3 47.64,24.24 44.45,27.43 R12.1
RELAY1_NO
  Top 1.016: K1.4 95.58,21.59 114.81,21.59 116.08,20.32 116.08,9.14 117.29,7.93 J5.1
RELAY2_NO
  Top 1.016: J5.5 123.27,2.88 122.43,2.03 104.39,2.03 100.84,5.59 95.49,5.59 K2.4
RESET
  Top 0.305: 31.24,19.3 35.31,19.3 35.56,19.56
  Top 0.406: BP1.2 5.33,20.34 | 5.33,20.34 BP1.1 | U1.13 53.19,15.09 51.82,13.72 31.75,13.72 30.99,14.48 30.99,19.05 31.24,19.3 | D3.A 5.33,20.34 | 35.56,19.56 J6.5
  Top 0.61: R9.2 4.95,17.65 D3.A
  Bottom 0.406: J6.5 35.56,21.59 35.05,22.1 10.41,22.1 9.65,21.34 9.65,20.4 BP1.1
SCL  (via drill 0.6)
  Top 0.406: J4.4 6.24,33.13 7.62,31.75 10.72,31.75 | 10.72,31.75 U2.6 | 10.72,31.75 12.95,31.75 14.48,30.23 14.48,21.84 17.27,19.05 17.27,14.73 | U1.18 57.19,12.74 v57.15,12.7 | v20.32,14.73 17.27,14.73 | 17.27,14.73 16.13,14.73 R14.1
  Bottom 0.406: v57.15,12.7 55.88,11.43 46.99,11.43 45.72,10.16 45.72,2.54 44.45,1.27 22.86,1.27 20.32,3.81 v20.32,14.73
SCLK
  Top 0.406: U1.9 48.91,19.44 47.24,17.78 35.81,17.78 J6.3
SDA  (via drill 0.6)
  Top 0.406: U1.19 57.99,13.89 58.17,13.72 58.17,5.59 57.4,4.83 50.29,4.83 47.5,7.62 43.18,7.62 39.37,11.43 13.97,11.43 12.7,12.7 v12.7,13.72 R13.1 | J4.3 7.87,36.52 7.87,33.78 8.26,33.4 U2.5
  Bottom 0.406: J4.3 6.73,37.72 7.87,36.58 7.87,14.73 8.89,13.72 v12.7,13.72

### Text on the board
tNames: I2C_OP | RELAY1_OP | MOSI | SCLK | MISO | RELAY2_OP | Urban Potager v5
bNames: PHOTORES_OP | DHT11_OP | BTCOMM_OP